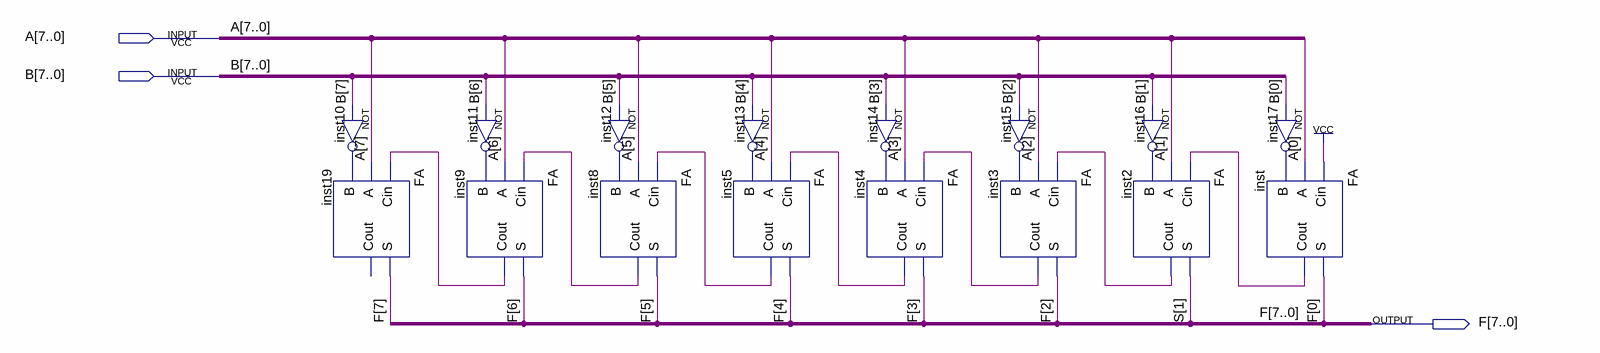
[diagram p0: schematic sheet]
// Quartus schematic SUB.bdf as structural Verilog: 16 symbols, 3 pins
module SUB (
  input  [7:0] A,
  input  [7:0] B,
  output [7:0] F
);

  wire inst2_cout, inst3_cout, inst4_cout, inst5_cout, inst8_cout, inst9_cout, inst10_out, inst11_out,
       inst12_out, inst13_out, inst14_out, inst15_out, inst16_out, inst17_out, inst_cout;
  wire [1:1] S;

  not inst10 (inst10_out, B[7]);
  FA inst19 (.Cin(inst9_cout), .A(A[7]), .B(inst10_out), .S(F[7]));  // open: Cout
  FA inst9 (.Cin(inst8_cout), .A(A[6]), .B(inst11_out), .S(F[6]), .Cout(inst9_cout));
  not inst11 (inst11_out, B[6]);
  not inst12 (inst12_out, B[5]);
  FA inst8 (.Cin(inst5_cout), .A(A[5]), .B(inst12_out), .S(F[5]), .Cout(inst8_cout));
  not inst13 (inst13_out, B[4]);
  FA inst5 (.Cin(inst4_cout), .A(A[4]), .B(inst13_out), .S(F[4]), .Cout(inst5_cout));
  not inst14 (inst14_out, B[3]);
  FA inst4 (.Cin(inst3_cout), .A(A[3]), .B(inst14_out), .S(F[3]), .Cout(inst4_cout));
  FA inst3 (.Cin(inst2_cout), .A(A[2]), .B(inst15_out), .S(F[2]), .Cout(inst3_cout));
  not inst15 (inst15_out, B[2]);
  not inst16 (inst16_out, B[1]);
  FA inst2 (.Cin(inst_cout), .A(A[1]), .B(inst16_out), .S(S[1]), .Cout(inst2_cout));
  not inst17 (inst17_out, B[0]);
  FA inst (.Cin(1'b1), .A(A[0]), .B(inst17_out), .S(F[0]), .Cout(inst_cout));
endmodule
